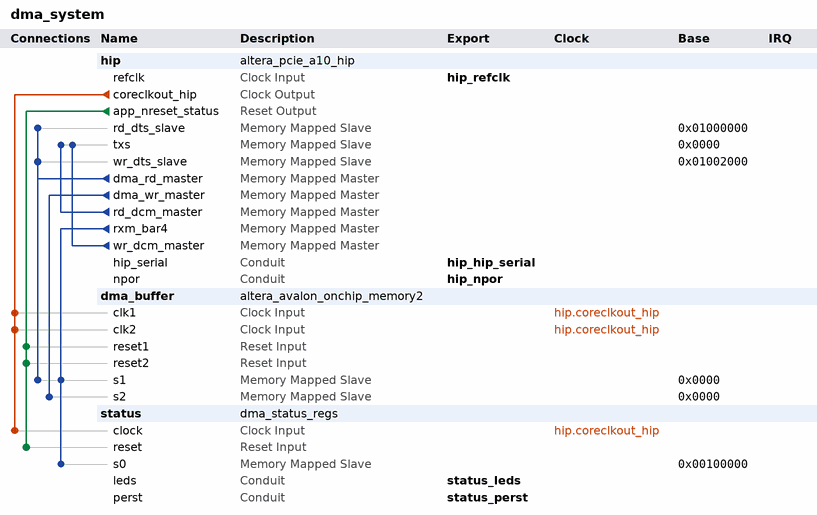
[diagram p0: system contents]
# Platform Designer (Qsys) system dma_system, Arria 10 10AX115N4F40E3SG
# Parameters at their usual value, and those the tool derives, are not listed.
package require -exact qsys 22.1
create_system dma_system
set_project_property DEVICE_FAMILY {Arria 10}
set_project_property DEVICE 10AX115N4F40E3SG

add_instance hip altera_pcie_a10_hip 22.1
set_instance_parameter_value hip adme_enable_hwtcl 0
set_instance_parameter_value hip advance_error_reporting_hwtcl 0
set_instance_parameter_value hip apps_type_hwtcl 0
set_instance_parameter_value hip ari_support_hwtcl 0
set_instance_parameter_value hip ast_trs_num_desc_hwtcl 16
set_instance_parameter_value hip ast_trs_rxdata_width_hwtcl 256
set_instance_parameter_value hip ast_trs_rxdesc_width_hwtcl 256
set_instance_parameter_value hip ast_trs_rxmty_width_hwtcl 32
set_instance_parameter_value hip ast_trs_txdata_width_hwtcl 256
set_instance_parameter_value hip ast_trs_txdesc_width_hwtcl 256
set_instance_parameter_value hip ast_trs_txmty_width_hwtcl 32
set_instance_parameter_value hip ast_trs_txstatus_width_hwtcl 256
set_instance_parameter_value hip avmm_addr_width_hwtcl 64
set_instance_parameter_value hip bar0_address_width_hwtcl 28
set_instance_parameter_value hip bar0_type_hwtcl {64-bit prefetchable memory}
set_instance_parameter_value hip bar1_address_width_hwtcl 0
set_instance_parameter_value hip bar1_type_hwtcl Disabled
set_instance_parameter_value hip bar2_address_width_hwtcl 8
set_instance_parameter_value hip bar2_type_hwtcl Disabled
set_instance_parameter_value hip bar3_address_width_hwtcl 0
set_instance_parameter_value hip bar3_type_hwtcl Disabled
set_instance_parameter_value hip bar4_address_width_hwtcl 21
set_instance_parameter_value hip bar4_type_hwtcl {64-bit prefetchable memory}
set_instance_parameter_value hip base_device NIGHTFURY5
set_instance_parameter_value hip bfm_drive_interface_clk_hwtcl 1
set_instance_parameter_value hip bfm_drive_interface_control_hwtcl 1
set_instance_parameter_value hip bfm_drive_interface_npor_hwtcl 1
set_instance_parameter_value hip bfm_drive_interface_pipe_hwtcl 1
set_instance_parameter_value hip cg_a2p_addr_map_pass_thru_bits_hwtcl 12
set_instance_parameter_value hip cg_enable_a2p_interrupt_hwtcl 0
set_instance_parameter_value hip cg_enable_advanced_interrupt_hwtcl 0
set_instance_parameter_value hip cg_impl_cra_av_slave_port_hwtcl 0
set_instance_parameter_value hip class_code_hwtcl 0
set_instance_parameter_value hip completion_timeout_hwtcl NONE
set_instance_parameter_value hip cseb_autonomous_hwtcl 0
set_instance_parameter_value hip cseb_config_bypass_gui_hwtcl 0
set_instance_parameter_value hip design_environment_hwtcl QSYS
set_instance_parameter_value hip devhide_support_hwtcl 0
set_instance_parameter_value hip device_embedded_ep_support_hwtcl 0
set_instance_parameter_value hip device_id_hwtcl 57348
set_instance_parameter_value hip dis_adapt 0
set_instance_parameter_value hip dma_use_scfifo_ext_hwtcl 0
set_instance_parameter_value hip eco_fb332688_dis_hwtcl 0
set_instance_parameter_value hip ecrc_check_capable_hwtcl 0
set_instance_parameter_value hip ecrc_gen_capable_hwtcl 0
set_instance_parameter_value hip enable_alternate_link_list_hwtcl 0
set_instance_parameter_value hip enable_ast_trs_hwtcl 0
set_instance_parameter_value hip enable_avst_reset_hwtcl 1
set_instance_parameter_value hip enable_custom_features_hwtcl 0
set_instance_parameter_value hip enable_devkit_conduit_hwtcl 0
set_instance_parameter_value hip enable_example_design_qii_hwtcl 1
set_instance_parameter_value hip enable_example_design_sim_hwtcl 1
set_instance_parameter_value hip enable_example_design_synth_hwtcl 1
set_instance_parameter_value hip enable_example_design_tb_hwtcl 1
set_instance_parameter_value hip enable_g3_bypass_equlz_rp_sim_hwtcl 0
set_instance_parameter_value hip enable_gen3phase2eq_timechange 0
set_instance_parameter_value hip enable_hip_status_for_avmm_hwtcl 0
set_instance_parameter_value hip enable_lmi_hwtcl 0
set_instance_parameter_value hip enable_nobar_slection_hwtcl 0
set_instance_parameter_value hip enable_rxm_burst_hwtcl 0
set_instance_parameter_value hip enable_skp_det 0
set_instance_parameter_value hip enable_soft_dfe 0
set_instance_parameter_value hip export_fpll_output_to_top_level_hwtcl 0
set_instance_parameter_value hip export_phy_input_to_top_level_hwtcl 0
set_instance_parameter_value hip extended_tag_support_hwtcl 0
set_instance_parameter_value hip flr_capability_user_hwtcl 0
set_instance_parameter_value hip force_tag_checking_on_hwtcl 0
set_instance_parameter_value hip gen3_coeff_1_hwtcl 8
set_instance_parameter_value hip gen3_coeff_3_ber_meas_hwtcl 12ms
set_instance_parameter_value hip include_virtio_capabilities_hwtcl 0
set_instance_parameter_value hip interface_type_hwtcl {Avalon-MM with DMA}
set_instance_parameter_value hip internal_controller_hwtcl 1
set_instance_parameter_value hip link2csr_width_hwtcl 16
set_instance_parameter_value hip maximum_payload_size_hwtcl 256
set_instance_parameter_value hip part_trait_device 10AX115N4F40E3SG
set_instance_parameter_value hip pf0_ats_invalidate_queue_depth_hwtcl 0
set_instance_parameter_value hip pf0_bar0_prefetchable_hwtcl 1
set_instance_parameter_value hip pf0_bar0_present_hwtcl 1
set_instance_parameter_value hip pf0_bar0_size_hwtcl 12
set_instance_parameter_value hip pf0_bar0_type_hwtcl 1
set_instance_parameter_value hip pf0_bar1_prefetchable_hwtcl 1
set_instance_parameter_value hip pf0_bar1_present_hwtcl 0
set_instance_parameter_value hip pf0_bar1_size_hwtcl 12
set_instance_parameter_value hip pf0_bar2_prefetchable_hwtcl 1
set_instance_parameter_value hip pf0_bar2_present_hwtcl 0
set_instance_parameter_value hip pf0_bar2_size_hwtcl 12
set_instance_parameter_value hip pf0_bar2_type_hwtcl 1
set_instance_parameter_value hip pf0_bar3_prefetchable_hwtcl 1
set_instance_parameter_value hip pf0_bar3_present_hwtcl 0
set_instance_parameter_value hip pf0_bar3_size_hwtcl 12
set_instance_parameter_value hip pf0_bar4_prefetchable_hwtcl 1
set_instance_parameter_value hip pf0_bar4_present_hwtcl 0
set_instance_parameter_value hip pf0_bar4_size_hwtcl 12
set_instance_parameter_value hip pf0_bar4_type_hwtcl 1
set_instance_parameter_value hip pf0_bar5_prefetchable_hwtcl 1
set_instance_parameter_value hip pf0_bar5_present_hwtcl 0
set_instance_parameter_value hip pf0_bar5_size_hwtcl 12
set_instance_parameter_value hip pf0_exprom_bar_present_hwtcl 0
set_instance_parameter_value hip pf0_exprom_bar_size_hwtcl 12
set_instance_parameter_value hip pf0_extra_bar_present_hwtcl 0
set_instance_parameter_value hip pf0_extra_bar_size_hwtcl 12
set_instance_parameter_value hip pf0_interrupt_pin_hwtcl inta
set_instance_parameter_value hip pf0_intr_line_hwtcl 0
set_instance_parameter_value hip pf0_msi_multi_message_capable_hwtcl 4
set_instance_parameter_value hip pf0_msix_pba_bir_hwtcl 0
set_instance_parameter_value hip pf0_msix_pba_offset_hwtcl 0
set_instance_parameter_value hip pf0_msix_table_bir_hwtcl 0
set_instance_parameter_value hip pf0_msix_table_offset_hwtcl 0
set_instance_parameter_value hip pf0_msix_table_size_hwtcl 0
set_instance_parameter_value hip pf0_pci_prog_intfc_byte_hwtcl 0
set_instance_parameter_value hip pf0_subclass_code_hwtcl 0
set_instance_parameter_value hip pf0_tph_dev_specific_mode_support_hwtcl 0
set_instance_parameter_value hip pf0_tph_int_mode_support_hwtcl 0
set_instance_parameter_value hip pf0_tph_st_table_location_hwtcl 0
set_instance_parameter_value hip pf0_tph_st_table_size_hwtcl 63
set_instance_parameter_value hip pf0_vf_bar0_prefetchable_hwtcl 1
set_instance_parameter_value hip pf0_vf_bar0_present_hwtcl 0
set_instance_parameter_value hip pf0_vf_bar0_size_hwtcl 12
set_instance_parameter_value hip pf0_vf_bar0_type_hwtcl 1
set_instance_parameter_value hip pf0_vf_bar1_prefetchable_hwtcl 1
set_instance_parameter_value hip pf0_vf_bar1_present_hwtcl 0
set_instance_parameter_value hip pf0_vf_bar1_size_hwtcl 12
set_instance_parameter_value hip pf0_vf_bar2_prefetchable_hwtcl 1
set_instance_parameter_value hip pf0_vf_bar2_present_hwtcl 0
set_instance_parameter_value hip pf0_vf_bar2_size_hwtcl 12
set_instance_parameter_value hip pf0_vf_bar2_type_hwtcl 1
set_instance_parameter_value hip pf0_vf_bar3_prefetchable_hwtcl 1
set_instance_parameter_value hip pf0_vf_bar3_present_hwtcl 0
set_instance_parameter_value hip pf0_vf_bar3_size_hwtcl 12
set_instance_parameter_value hip pf0_vf_bar4_prefetchable_hwtcl 1
set_instance_parameter_value hip pf0_vf_bar4_present_hwtcl 0
set_instance_parameter_value hip pf0_vf_bar4_size_hwtcl 12
set_instance_parameter_value hip pf0_vf_bar4_type_hwtcl 1
set_instance_parameter_value hip pf0_vf_bar5_prefetchable_hwtcl 1
set_instance_parameter_value hip pf0_vf_bar5_present_hwtcl 0
set_instance_parameter_value hip pf0_vf_bar5_size_hwtcl 12
set_instance_parameter_value hip pf0_vf_count_user_hwtcl 0
set_instance_parameter_value hip pf0_vf_device_id_hwtcl 0
set_instance_parameter_value hip pf0_vf_msix_pba_bir_hwtcl 0
set_instance_parameter_value hip pf0_vf_msix_pba_offset_hwtcl 0
set_instance_parameter_value hip pf0_vf_msix_tbl_bir_hwtcl 0
set_instance_parameter_value hip pf0_vf_msix_tbl_offset_hwtcl 0
set_instance_parameter_value hip pf0_vf_msix_tbl_size_hwtcl 0
set_instance_parameter_value hip pf0_vf_subsystem_device_id_hwtcl 0
set_instance_parameter_value hip pf0_vf_tph_dev_specific_mode_support_hwtcl 0
set_instance_parameter_value hip pf0_vf_tph_int_mode_support_hwtcl 0
set_instance_parameter_value hip pf0_vf_tph_st_table_location_hwtcl 0
set_instance_parameter_value hip pf0_vf_tph_st_table_size_hwtcl 63
set_instance_parameter_value hip pf0_virtio_capability_present_hwtcl 0
set_instance_parameter_value hip pf0_virtio_cmn_config_bar_indicator_hwtcl 0
set_instance_parameter_value hip pf0_virtio_cmn_config_bar_offset_hwtcl 0
set_instance_parameter_value hip pf0_virtio_cmn_config_structure_length_hwtcl 0
set_instance_parameter_value hip pf0_virtio_device_specific_cap_present_hwtcl 0
set_instance_parameter_value hip pf0_virtio_devspecific_bar_indicator_hwtcl 0
set_instance_parameter_value hip pf0_virtio_devspecific_bar_offset_hwtcl 0
set_instance_parameter_value hip pf0_virtio_devspecific_structure_length_hwtcl 0
set_instance_parameter_value hip pf0_virtio_isrstatus_bar_indicator_hwtcl 0
set_instance_parameter_value hip pf0_virtio_isrstatus_bar_offset_hwtcl 0
set_instance_parameter_value hip pf0_virtio_isrstatus_structure_length_hwtcl 0
set_instance_parameter_value hip pf0_virtio_notification_bar_indicator_hwtcl 0
set_instance_parameter_value hip pf0_virtio_notification_bar_offset_hwtcl 0
set_instance_parameter_value hip pf0_virtio_notification_structure_length_hwtcl 0
set_instance_parameter_value hip pf0_virtio_notify_off_multiplier_hwtcl 0
set_instance_parameter_value hip pf0_virtio_pciconfig_access_bar_indicator_hwtcl 0
set_instance_parameter_value hip pf0_virtio_pciconfig_access_bar_offset_hwtcl 0
set_instance_parameter_value hip pf0_virtio_pciconfig_access_structure_length_hwtcl 0
set_instance_parameter_value hip pf0vf_virtio_capability_present_hwtcl 0
set_instance_parameter_value hip pf0vf_virtio_cmn_config_bar_indicator_hwtcl 0
set_instance_parameter_value hip pf0vf_virtio_cmn_config_bar_offset_hwtcl 0
set_instance_parameter_value hip pf0vf_virtio_cmn_config_structure_length_hwtcl 0
set_instance_parameter_value hip pf0vf_virtio_device_specific_cap_present_hwtcl 0
set_instance_parameter_value hip pf0vf_virtio_devspecific_bar_indicator_hwtcl 0
set_instance_parameter_value hip pf0vf_virtio_devspecific_bar_offset_hwtcl 0
set_instance_parameter_value hip pf0vf_virtio_devspecific_structure_length_hwtcl 0
set_instance_parameter_value hip pf0vf_virtio_isrstatus_bar_indicator_hwtcl 0
set_instance_parameter_value hip pf0vf_virtio_isrstatus_bar_offset_hwtcl 0
set_instance_parameter_value hip pf0vf_virtio_isrstatus_structure_length_hwtcl 0
set_instance_parameter_value hip pf0vf_virtio_notification_bar_indicator_hwtcl 0
set_instance_parameter_value hip pf0vf_virtio_notification_bar_offset_hwtcl 0
set_instance_parameter_value hip pf0vf_virtio_notification_structure_length_hwtcl 0
set_instance_parameter_value hip pf0vf_virtio_notify_off_multiplier_hwtcl 0
set_instance_parameter_value hip pf0vf_virtio_pciconfig_access_bar_indicator_hwtcl 0
set_instance_parameter_value hip pf0vf_virtio_pciconfig_access_bar_offset_hwtcl 0
set_instance_parameter_value hip pf0vf_virtio_pciconfig_access_structure_length_hwtcl 0
set_instance_parameter_value hip pf1_ats_invalidate_queue_depth_hwtcl 0
set_instance_parameter_value hip pf1_bar0_prefetchable_hwtcl 1
set_instance_parameter_value hip pf1_bar0_present_hwtcl 0
set_instance_parameter_value hip pf1_bar0_size_hwtcl 12
set_instance_parameter_value hip pf1_bar0_type_hwtcl 1
set_instance_parameter_value hip pf1_bar1_prefetchable_hwtcl 1
set_instance_parameter_value hip pf1_bar1_present_hwtcl 0
set_instance_parameter_value hip pf1_bar1_size_hwtcl 12
set_instance_parameter_value hip pf1_bar2_prefetchable_hwtcl 1
set_instance_parameter_value hip pf1_bar2_present_hwtcl 0
set_instance_parameter_value hip pf1_bar2_size_hwtcl 12
set_instance_parameter_value hip pf1_bar2_type_hwtcl 1
set_instance_parameter_value hip pf1_bar3_prefetchable_hwtcl 1
set_instance_parameter_value hip pf1_bar3_present_hwtcl 0
set_instance_parameter_value hip pf1_bar3_size_hwtcl 12
set_instance_parameter_value hip pf1_bar4_prefetchable_hwtcl 1
set_instance_parameter_value hip pf1_bar4_present_hwtcl 0
set_instance_parameter_value hip pf1_bar4_size_hwtcl 12
set_instance_parameter_value hip pf1_bar4_type_hwtcl 1
set_instance_parameter_value hip pf1_bar5_prefetchable_hwtcl 1
set_instance_parameter_value hip pf1_bar5_present_hwtcl 0
set_instance_parameter_value hip pf1_bar5_size_hwtcl 12
set_instance_parameter_value hip pf1_class_code_hwtcl 0
set_instance_parameter_value hip pf1_device_id_hwtcl 0
set_instance_parameter_value hip pf1_exprom_bar_present_hwtcl 0
set_instance_parameter_value hip pf1_exprom_bar_size_hwtcl 12
set_instance_parameter_value hip pf1_interrupt_pin_hwtcl inta
set_instance_parameter_value hip pf1_intr_line_hwtcl 0
set_instance_parameter_value hip pf1_msi_multi_message_capable_hwtcl 4
set_instance_parameter_value hip pf1_msix_pba_bir_hwtcl 0
set_instance_parameter_value hip pf1_msix_pba_offset_hwtcl 0
set_instance_parameter_value hip pf1_msix_table_bir_hwtcl 0
set_instance_parameter_value hip pf1_msix_table_offset_hwtcl 0
set_instance_parameter_value hip pf1_msix_table_size_hwtcl 0
set_instance_parameter_value hip pf1_pci_prog_intfc_byte_hwtcl 0
set_instance_parameter_value hip pf1_revision_id_hwtcl 0
set_instance_parameter_value hip pf1_subclass_code_hwtcl 0
set_instance_parameter_value hip pf1_subsystem_device_id_hwtcl 0
set_instance_parameter_value hip pf1_subsystem_vendor_id_hwtcl 0
set_instance_parameter_value hip pf1_tph_dev_specific_mode_support_hwtcl 0
set_instance_parameter_value hip pf1_tph_int_mode_support_hwtcl 0
set_instance_parameter_value hip pf1_tph_st_table_location_hwtcl 0
set_instance_parameter_value hip pf1_tph_st_table_size_hwtcl 63
set_instance_parameter_value hip pf1_vendor_id_hwtcl 0
set_instance_parameter_value hip pf1_vf_bar0_prefetchable_hwtcl 1
set_instance_parameter_value hip pf1_vf_bar0_present_hwtcl 0
set_instance_parameter_value hip pf1_vf_bar0_size_hwtcl 12
set_instance_parameter_value hip pf1_vf_bar0_type_hwtcl 1
set_instance_parameter_value hip pf1_vf_bar1_prefetchable_hwtcl 1
set_instance_parameter_value hip pf1_vf_bar1_present_hwtcl 0
set_instance_parameter_value hip pf1_vf_bar1_size_hwtcl 12
set_instance_parameter_value hip pf1_vf_bar2_prefetchable_hwtcl 1
set_instance_parameter_value hip pf1_vf_bar2_present_hwtcl 0
set_instance_parameter_value hip pf1_vf_bar2_size_hwtcl 12
set_instance_parameter_value hip pf1_vf_bar2_type_hwtcl 1
set_instance_parameter_value hip pf1_vf_bar3_prefetchable_hwtcl 1
set_instance_parameter_value hip pf1_vf_bar3_present_hwtcl 0
set_instance_parameter_value hip pf1_vf_bar3_size_hwtcl 12
set_instance_parameter_value hip pf1_vf_bar4_prefetchable_hwtcl 1
set_instance_parameter_value hip pf1_vf_bar4_present_hwtcl 0
set_instance_parameter_value hip pf1_vf_bar4_size_hwtcl 12
set_instance_parameter_value hip pf1_vf_bar4_type_hwtcl 1
set_instance_parameter_value hip pf1_vf_bar5_prefetchable_hwtcl 1
set_instance_parameter_value hip pf1_vf_bar5_present_hwtcl 0
set_instance_parameter_value hip pf1_vf_bar5_size_hwtcl 12
set_instance_parameter_value hip pf1_vf_count_user_hwtcl 0
set_instance_parameter_value hip pf1_vf_device_id_hwtcl 0
set_instance_parameter_value hip pf1_vf_msix_pba_bir_hwtcl 0
set_instance_parameter_value hip pf1_vf_msix_pba_offset_hwtcl 0
set_instance_parameter_value hip pf1_vf_msix_tbl_bir_hwtcl 0
set_instance_parameter_value hip pf1_vf_msix_tbl_offset_hwtcl 0
set_instance_parameter_value hip pf1_vf_msix_tbl_size_hwtcl 0
set_instance_parameter_value hip pf1_vf_subsystem_device_id_hwtcl 0
set_instance_parameter_value hip pf1_vf_tph_dev_specific_mode_support_hwtcl 0
set_instance_parameter_value hip pf1_vf_tph_int_mode_support_hwtcl 0
set_instance_parameter_value hip pf1_vf_tph_st_table_location_hwtcl 0
set_instance_parameter_value hip pf1_vf_tph_st_table_size_hwtcl 63
set_instance_parameter_value hip pf1_virtio_capability_present_hwtcl 0
set_instance_parameter_value hip pf1_virtio_cmn_config_bar_indicator_hwtcl 0
set_instance_parameter_value hip pf1_virtio_cmn_config_bar_offset_hwtcl 0
set_instance_parameter_value hip pf1_virtio_cmn_config_structure_length_hwtcl 0
set_instance_parameter_value hip pf1_virtio_device_specific_cap_present_hwtcl 0
set_instance_parameter_value hip pf1_virtio_devspecific_bar_indicator_hwtcl 0
set_instance_parameter_value hip pf1_virtio_devspecific_bar_offset_hwtcl 0
set_instance_parameter_value hip pf1_virtio_devspecific_structure_length_hwtcl 0
set_instance_parameter_value hip pf1_virtio_isrstatus_bar_indicator_hwtcl 0
set_instance_parameter_value hip pf1_virtio_isrstatus_bar_offset_hwtcl 0
set_instance_parameter_value hip pf1_virtio_isrstatus_structure_length_hwtcl 0
set_instance_parameter_value hip pf1_virtio_notification_bar_indicator_hwtcl 0
set_instance_parameter_value hip pf1_virtio_notification_bar_offset_hwtcl 0
set_instance_parameter_value hip pf1_virtio_notification_structure_length_hwtcl 0
set_instance_parameter_value hip pf1_virtio_notify_off_multiplier_hwtcl 0
set_instance_parameter_value hip pf1_virtio_pciconfig_access_bar_indicator_hwtcl 0
set_instance_parameter_value hip pf1_virtio_pciconfig_access_bar_offset_hwtcl 0
set_instance_parameter_value hip pf1_virtio_pciconfig_access_structure_length_hwtcl 0
set_instance_parameter_value hip pf1vf_virtio_capability_present_hwtcl 0
set_instance_parameter_value hip pf1vf_virtio_cmn_config_bar_indicator_hwtcl 0
set_instance_parameter_value hip pf1vf_virtio_cmn_config_bar_offset_hwtcl 0
set_instance_parameter_value hip pf1vf_virtio_cmn_config_structure_length_hwtcl 0
set_instance_parameter_value hip pf1vf_virtio_device_specific_cap_present_hwtcl 0
set_instance_parameter_value hip pf1vf_virtio_devspecific_bar_indicator_hwtcl 0
set_instance_parameter_value hip pf1vf_virtio_devspecific_bar_offset_hwtcl 0
set_instance_parameter_value hip pf1vf_virtio_devspecific_structure_length_hwtcl 0
set_instance_parameter_value hip pf1vf_virtio_isrstatus_bar_indicator_hwtcl 0
set_instance_parameter_value hip pf1vf_virtio_isrstatus_bar_offset_hwtcl 0
set_instance_parameter_value hip pf1vf_virtio_isrstatus_structure_length_hwtcl 0
set_instance_parameter_value hip pf1vf_virtio_notification_bar_indicator_hwtcl 0
set_instance_parameter_value hip pf1vf_virtio_notification_bar_offset_hwtcl 0
set_instance_parameter_value hip pf1vf_virtio_notification_structure_length_hwtcl 0
set_instance_parameter_value hip pf1vf_virtio_notify_off_multiplier_hwtcl 0
set_instance_parameter_value hip pf1vf_virtio_pciconfig_access_bar_indicator_hwtcl 0
set_instance_parameter_value hip pf1vf_virtio_pciconfig_access_bar_offset_hwtcl 0
set_instance_parameter_value hip pf1vf_virtio_pciconfig_access_structure_length_hwtcl 0
set_instance_parameter_value hip pf2_ats_invalidate_queue_depth_hwtcl 0
set_instance_parameter_value hip pf2_bar0_prefetchable_hwtcl 1
set_instance_parameter_value hip pf2_bar0_present_hwtcl 0
set_instance_parameter_value hip pf2_bar0_size_hwtcl 12
set_instance_parameter_value hip pf2_bar0_type_hwtcl 1
set_instance_parameter_value hip pf2_bar1_prefetchable_hwtcl 1
set_instance_parameter_value hip pf2_bar1_present_hwtcl 0
set_instance_parameter_value hip pf2_bar1_size_hwtcl 12
set_instance_parameter_value hip pf2_bar2_prefetchable_hwtcl 1
set_instance_parameter_value hip pf2_bar2_present_hwtcl 0
set_instance_parameter_value hip pf2_bar2_size_hwtcl 12
set_instance_parameter_value hip pf2_bar2_type_hwtcl 1
set_instance_parameter_value hip pf2_bar3_prefetchable_hwtcl 1
set_instance_parameter_value hip pf2_bar3_present_hwtcl 0
set_instance_parameter_value hip pf2_bar3_size_hwtcl 12
set_instance_parameter_value hip pf2_bar4_prefetchable_hwtcl 1
set_instance_parameter_value hip pf2_bar4_present_hwtcl 0
set_instance_parameter_value hip pf2_bar4_size_hwtcl 12
set_instance_parameter_value hip pf2_bar4_type_hwtcl 1
set_instance_parameter_value hip pf2_bar5_prefetchable_hwtcl 1
set_instance_parameter_value hip pf2_bar5_present_hwtcl 0
set_instance_parameter_value hip pf2_bar5_size_hwtcl 12
set_instance_parameter_value hip pf2_class_code_hwtcl 0
set_instance_parameter_value hip pf2_device_id_hwtcl 0
set_instance_parameter_value hip pf2_exprom_bar_present_hwtcl 0
set_instance_parameter_value hip pf2_exprom_bar_size_hwtcl 12
set_instance_parameter_value hip pf2_interrupt_pin_hwtcl inta
set_instance_parameter_value hip pf2_intr_line_hwtcl 0
set_instance_parameter_value hip pf2_msi_multi_message_capable_hwtcl 4
set_instance_parameter_value hip pf2_msix_pba_bir_hwtcl 0
set_instance_parameter_value hip pf2_msix_pba_offset_hwtcl 0
set_instance_parameter_value hip pf2_msix_table_bir_hwtcl 0
set_instance_parameter_value hip pf2_msix_table_offset_hwtcl 0
set_instance_parameter_value hip pf2_msix_table_size_hwtcl 0
set_instance_parameter_value hip pf2_pci_prog_intfc_byte_hwtcl 0
set_instance_parameter_value hip pf2_revision_id_hwtcl 0
set_instance_parameter_value hip pf2_subclass_code_hwtcl 0
set_instance_parameter_value hip pf2_subsystem_device_id_hwtcl 0
set_instance_parameter_value hip pf2_subsystem_vendor_id_hwtcl 0
set_instance_parameter_value hip pf2_tph_dev_specific_mode_support_hwtcl 0
set_instance_parameter_value hip pf2_tph_int_mode_support_hwtcl 0
set_instance_parameter_value hip pf2_tph_st_table_location_hwtcl 0
set_instance_parameter_value hip pf2_tph_st_table_size_hwtcl 63
set_instance_parameter_value hip pf2_vendor_id_hwtcl 0
set_instance_parameter_value hip pf2_vf_bar0_prefetchable_hwtcl 1
set_instance_parameter_value hip pf2_vf_bar0_present_hwtcl 0
set_instance_parameter_value hip pf2_vf_bar0_size_hwtcl 12
set_instance_parameter_value hip pf2_vf_bar0_type_hwtcl 1
set_instance_parameter_value hip pf2_vf_bar1_prefetchable_hwtcl 1
set_instance_parameter_value hip pf2_vf_bar1_present_hwtcl 0
set_instance_parameter_value hip pf2_vf_bar1_size_hwtcl 12
set_instance_parameter_value hip pf2_vf_bar2_prefetchable_hwtcl 1
set_instance_parameter_value hip pf2_vf_bar2_present_hwtcl 0
set_instance_parameter_value hip pf2_vf_bar2_size_hwtcl 12
set_instance_parameter_value hip pf2_vf_bar2_type_hwtcl 1
set_instance_parameter_value hip pf2_vf_bar3_prefetchable_hwtcl 1
set_instance_parameter_value hip pf2_vf_bar3_present_hwtcl 0
set_instance_parameter_value hip pf2_vf_bar3_size_hwtcl 12
set_instance_parameter_value hip pf2_vf_bar4_prefetchable_hwtcl 1
set_instance_parameter_value hip pf2_vf_bar4_present_hwtcl 0
set_instance_parameter_value hip pf2_vf_bar4_size_hwtcl 12
set_instance_parameter_value hip pf2_vf_bar4_type_hwtcl 1
set_instance_parameter_value hip pf2_vf_bar5_prefetchable_hwtcl 1
set_instance_parameter_value hip pf2_vf_bar5_present_hwtcl 0
set_instance_parameter_value hip pf2_vf_bar5_size_hwtcl 12
set_instance_parameter_value hip pf2_vf_count_user_hwtcl 0
set_instance_parameter_value hip pf2_vf_device_id_hwtcl 0
set_instance_parameter_value hip pf2_vf_msix_pba_bir_hwtcl 0
set_instance_parameter_value hip pf2_vf_msix_pba_offset_hwtcl 0
set_instance_parameter_value hip pf2_vf_msix_tbl_bir_hwtcl 0
set_instance_parameter_value hip pf2_vf_msix_tbl_offset_hwtcl 0
set_instance_parameter_value hip pf2_vf_msix_tbl_size_hwtcl 0
set_instance_parameter_value hip pf2_vf_subsystem_device_id_hwtcl 0
set_instance_parameter_value hip pf2_vf_tph_dev_specific_mode_support_hwtcl 0
set_instance_parameter_value hip pf2_vf_tph_int_mode_support_hwtcl 0
set_instance_parameter_value hip pf2_vf_tph_st_table_location_hwtcl 0
set_instance_parameter_value hip pf2_vf_tph_st_table_size_hwtcl 63
set_instance_parameter_value hip pf2_virtio_capability_present_hwtcl 0
set_instance_parameter_value hip pf2_virtio_cmn_config_bar_indicator_hwtcl 0
set_instance_parameter_value hip pf2_virtio_cmn_config_bar_offset_hwtcl 0
set_instance_parameter_value hip pf2_virtio_cmn_config_structure_length_hwtcl 0
set_instance_parameter_value hip pf2_virtio_device_specific_cap_present_hwtcl 0
set_instance_parameter_value hip pf2_virtio_devspecific_bar_indicator_hwtcl 0
set_instance_parameter_value hip pf2_virtio_devspecific_bar_offset_hwtcl 0
set_instance_parameter_value hip pf2_virtio_devspecific_structure_length_hwtcl 0
set_instance_parameter_value hip pf2_virtio_isrstatus_bar_indicator_hwtcl 0
set_instance_parameter_value hip pf2_virtio_isrstatus_bar_offset_hwtcl 0
set_instance_parameter_value hip pf2_virtio_isrstatus_structure_length_hwtcl 0
set_instance_parameter_value hip pf2_virtio_notification_bar_indicator_hwtcl 0
set_instance_parameter_value hip pf2_virtio_notification_bar_offset_hwtcl 0
set_instance_parameter_value hip pf2_virtio_notification_structure_length_hwtcl 0
set_instance_parameter_value hip pf2_virtio_notify_off_multiplier_hwtcl 0
set_instance_parameter_value hip pf2_virtio_pciconfig_access_bar_indicator_hwtcl 0
set_instance_parameter_value hip pf2_virtio_pciconfig_access_bar_offset_hwtcl 0
set_instance_parameter_value hip pf2_virtio_pciconfig_access_structure_length_hwtcl 0
set_instance_parameter_value hip pf2vf_virtio_capability_present_hwtcl 0
set_instance_parameter_value hip pf2vf_virtio_cmn_config_bar_indicator_hwtcl 0
set_instance_parameter_value hip pf2vf_virtio_cmn_config_bar_offset_hwtcl 0
set_instance_parameter_value hip pf2vf_virtio_cmn_config_structure_length_hwtcl 0
set_instance_parameter_value hip pf2vf_virtio_device_specific_cap_present_hwtcl 0
set_instance_parameter_value hip pf2vf_virtio_devspecific_bar_indicator_hwtcl 0
set_instance_parameter_value hip pf2vf_virtio_devspecific_bar_offset_hwtcl 0
set_instance_parameter_value hip pf2vf_virtio_devspecific_structure_length_hwtcl 0
set_instance_parameter_value hip pf2vf_virtio_isrstatus_bar_indicator_hwtcl 0
set_instance_parameter_value hip pf2vf_virtio_isrstatus_bar_offset_hwtcl 0
set_instance_parameter_value hip pf2vf_virtio_isrstatus_structure_length_hwtcl 0
set_instance_parameter_value hip pf2vf_virtio_notification_bar_indicator_hwtcl 0
set_instance_parameter_value hip pf2vf_virtio_notification_bar_offset_hwtcl 0
set_instance_parameter_value hip pf2vf_virtio_notification_structure_length_hwtcl 0
set_instance_parameter_value hip pf2vf_virtio_notify_off_multiplier_hwtcl 0
set_instance_parameter_value hip pf2vf_virtio_pciconfig_access_bar_indicator_hwtcl 0
set_instance_parameter_value hip pf2vf_virtio_pciconfig_access_bar_offset_hwtcl 0
set_instance_parameter_value hip pf2vf_virtio_pciconfig_access_structure_length_hwtcl 0
set_instance_parameter_value hip pf3_ats_invalidate_queue_depth_hwtcl 0
set_instance_parameter_value hip pf3_bar0_prefetchable_hwtcl 1
set_instance_parameter_value hip pf3_bar0_present_hwtcl 0
set_instance_parameter_value hip pf3_bar0_size_hwtcl 12
set_instance_parameter_value hip pf3_bar0_type_hwtcl 1
set_instance_parameter_value hip pf3_bar1_prefetchable_hwtcl 1
set_instance_parameter_value hip pf3_bar1_present_hwtcl 0
set_instance_parameter_value hip pf3_bar1_size_hwtcl 12
set_instance_parameter_value hip pf3_bar2_prefetchable_hwtcl 1
set_instance_parameter_value hip pf3_bar2_present_hwtcl 0
set_instance_parameter_value hip pf3_bar2_size_hwtcl 12
set_instance_parameter_value hip pf3_bar2_type_hwtcl 1
set_instance_parameter_value hip pf3_bar3_prefetchable_hwtcl 1
set_instance_parameter_value hip pf3_bar3_present_hwtcl 0
set_instance_parameter_value hip pf3_bar3_size_hwtcl 12
set_instance_parameter_value hip pf3_bar4_prefetchable_hwtcl 1
set_instance_parameter_value hip pf3_bar4_present_hwtcl 0
set_instance_parameter_value hip pf3_bar4_size_hwtcl 12
set_instance_parameter_value hip pf3_bar4_type_hwtcl 1
set_instance_parameter_value hip pf3_bar5_prefetchable_hwtcl 1
set_instance_parameter_value hip pf3_bar5_present_hwtcl 0
set_instance_parameter_value hip pf3_bar5_size_hwtcl 12
set_instance_parameter_value hip pf3_class_code_hwtcl 0
set_instance_parameter_value hip pf3_device_id_hwtcl 0
set_instance_parameter_value hip pf3_exprom_bar_present_hwtcl 0
set_instance_parameter_value hip pf3_exprom_bar_size_hwtcl 12
set_instance_parameter_value hip pf3_interrupt_pin_hwtcl inta
set_instance_parameter_value hip pf3_intr_line_hwtcl 0
set_instance_parameter_value hip pf3_msi_multi_message_capable_hwtcl 4
set_instance_parameter_value hip pf3_msix_pba_bir_hwtcl 0
set_instance_parameter_value hip pf3_msix_pba_offset_hwtcl 0
set_instance_parameter_value hip pf3_msix_table_bir_hwtcl 0
set_instance_parameter_value hip pf3_msix_table_offset_hwtcl 0
set_instance_parameter_value hip pf3_msix_table_size_hwtcl 0
set_instance_parameter_value hip pf3_pci_prog_intfc_byte_hwtcl 0
set_instance_parameter_value hip pf3_revision_id_hwtcl 0
set_instance_parameter_value hip pf3_subclass_code_hwtcl 0
set_instance_parameter_value hip pf3_subsystem_device_id_hwtcl 0
set_instance_parameter_value hip pf3_subsystem_vendor_id_hwtcl 0
set_instance_parameter_value hip pf3_tph_dev_specific_mode_support_hwtcl 0
set_instance_parameter_value hip pf3_tph_int_mode_support_hwtcl 0
set_instance_parameter_value hip pf3_tph_st_table_location_hwtcl 0
set_instance_parameter_value hip pf3_tph_st_table_size_hwtcl 63
set_instance_parameter_value hip pf3_vendor_id_hwtcl 0
set_instance_parameter_value hip pf3_vf_bar0_prefetchable_hwtcl 1
set_instance_parameter_value hip pf3_vf_bar0_present_hwtcl 0
set_instance_parameter_value hip pf3_vf_bar0_size_hwtcl 12
set_instance_parameter_value hip pf3_vf_bar0_type_hwtcl 1
set_instance_parameter_value hip pf3_vf_bar1_prefetchable_hwtcl 1
set_instance_parameter_value hip pf3_vf_bar1_present_hwtcl 0
set_instance_parameter_value hip pf3_vf_bar1_size_hwtcl 12
set_instance_parameter_value hip pf3_vf_bar2_prefetchable_hwtcl 1
set_instance_parameter_value hip pf3_vf_bar2_present_hwtcl 0
set_instance_parameter_value hip pf3_vf_bar2_size_hwtcl 12
set_instance_parameter_value hip pf3_vf_bar2_type_hwtcl 1
set_instance_parameter_value hip pf3_vf_bar3_prefetchable_hwtcl 1
set_instance_parameter_value hip pf3_vf_bar3_present_hwtcl 0
set_instance_parameter_value hip pf3_vf_bar3_size_hwtcl 12
set_instance_parameter_value hip pf3_vf_bar4_prefetchable_hwtcl 1
set_instance_parameter_value hip pf3_vf_bar4_present_hwtcl 0
set_instance_parameter_value hip pf3_vf_bar4_size_hwtcl 12
set_instance_parameter_value hip pf3_vf_bar4_type_hwtcl 1
set_instance_parameter_value hip pf3_vf_bar5_prefetchable_hwtcl 1
set_instance_parameter_value hip pf3_vf_bar5_present_hwtcl 0
set_instance_parameter_value hip pf3_vf_bar5_size_hwtcl 12
set_instance_parameter_value hip pf3_vf_count_user_hwtcl 0
set_instance_parameter_value hip pf3_vf_device_id_hwtcl 0
set_instance_parameter_value hip pf3_vf_msix_pba_bir_hwtcl 0
set_instance_parameter_value hip pf3_vf_msix_pba_offset_hwtcl 0
set_instance_parameter_value hip pf3_vf_msix_tbl_bir_hwtcl 0
set_instance_parameter_value hip pf3_vf_msix_tbl_offset_hwtcl 0
set_instance_parameter_value hip pf3_vf_msix_tbl_size_hwtcl 0
set_instance_parameter_value hip pf3_vf_subsystem_device_id_hwtcl 0
set_instance_parameter_value hip pf3_vf_tph_dev_specific_mode_support_hwtcl 0
set_instance_parameter_value hip pf3_vf_tph_int_mode_support_hwtcl 0
set_instance_parameter_value hip pf3_vf_tph_st_table_location_hwtcl 0
set_instance_parameter_value hip pf3_vf_tph_st_table_size_hwtcl 63
set_instance_parameter_value hip pf3_virtio_capability_present_hwtcl 0
set_instance_parameter_value hip pf3_virtio_cmn_config_bar_indicator_hwtcl 0
set_instance_parameter_value hip pf3_virtio_cmn_config_bar_offset_hwtcl 0
set_instance_parameter_value hip pf3_virtio_cmn_config_structure_length_hwtcl 0
set_instance_parameter_value hip pf3_virtio_device_specific_cap_present_hwtcl 0
set_instance_parameter_value hip pf3_virtio_devspecific_bar_indicator_hwtcl 0
set_instance_parameter_value hip pf3_virtio_devspecific_bar_offset_hwtcl 0
set_instance_parameter_value hip pf3_virtio_devspecific_structure_length_hwtcl 0
set_instance_parameter_value hip pf3_virtio_isrstatus_bar_indicator_hwtcl 0
set_instance_parameter_value hip pf3_virtio_isrstatus_bar_offset_hwtcl 0
set_instance_parameter_value hip pf3_virtio_isrstatus_structure_length_hwtcl 0
set_instance_parameter_value hip pf3_virtio_notification_bar_indicator_hwtcl 0
set_instance_parameter_value hip pf3_virtio_notification_bar_offset_hwtcl 0
set_instance_parameter_value hip pf3_virtio_notification_structure_length_hwtcl 0
set_instance_parameter_value hip pf3_virtio_notify_off_multiplier_hwtcl 0
set_instance_parameter_value hip pf3_virtio_pciconfig_access_bar_indicator_hwtcl 0
set_instance_parameter_value hip pf3_virtio_pciconfig_access_bar_offset_hwtcl 0
set_instance_parameter_value hip pf3_virtio_pciconfig_access_structure_length_hwtcl 0
set_instance_parameter_value hip pf3vf_virtio_capability_present_hwtcl 0
set_instance_parameter_value hip pf3vf_virtio_cmn_config_bar_indicator_hwtcl 0
set_instance_parameter_value hip pf3vf_virtio_cmn_config_bar_offset_hwtcl 0
set_instance_parameter_value hip pf3vf_virtio_cmn_config_structure_length_hwtcl 0
set_instance_parameter_value hip pf3vf_virtio_device_specific_cap_present_hwtcl 0
set_instance_parameter_value hip pf3vf_virtio_devspecific_bar_indicator_hwtcl 0
set_instance_parameter_value hip pf3vf_virtio_devspecific_bar_offset_hwtcl 0
set_instance_parameter_value hip pf3vf_virtio_devspecific_structure_length_hwtcl 0
set_instance_parameter_value hip pf3vf_virtio_isrstatus_bar_indicator_hwtcl 0
set_instance_parameter_value hip pf3vf_virtio_isrstatus_bar_offset_hwtcl 0
set_instance_parameter_value hip pf3vf_virtio_isrstatus_structure_length_hwtcl 0
set_instance_parameter_value hip pf3vf_virtio_notification_bar_indicator_hwtcl 0
set_instance_parameter_value hip pf3vf_virtio_notification_bar_offset_hwtcl 0
set_instance_parameter_value hip pf3vf_virtio_notification_structure_length_hwtcl 0
set_instance_parameter_value hip pf3vf_virtio_notify_off_multiplier_hwtcl 0
set_instance_parameter_value hip pf3vf_virtio_pciconfig_access_bar_indicator_hwtcl 0
set_instance_parameter_value hip pf3vf_virtio_pciconfig_access_bar_offset_hwtcl 0
set_instance_parameter_value hip pf3vf_virtio_pciconfig_access_structure_length_hwtcl 0
set_instance_parameter_value hip pf4_bar0_prefetchable_hwtcl 1
set_instance_parameter_value hip pf4_bar0_present_hwtcl 0
set_instance_parameter_value hip pf4_bar0_size_hwtcl 12
set_instance_parameter_value hip pf4_bar0_type_hwtcl 1
set_instance_parameter_value hip pf4_bar1_prefetchable_hwtcl 1
set_instance_parameter_value hip pf4_bar1_present_hwtcl 0
set_instance_parameter_value hip pf4_bar1_size_hwtcl 12
set_instance_parameter_value hip pf4_bar2_prefetchable_hwtcl 1
set_instance_parameter_value hip pf4_bar2_present_hwtcl 0
set_instance_parameter_value hip pf4_bar2_size_hwtcl 12
set_instance_parameter_value hip pf4_bar2_type_hwtcl 1
set_instance_parameter_value hip pf4_bar3_prefetchable_hwtcl 1
set_instance_parameter_value hip pf4_bar3_present_hwtcl 0
set_instance_parameter_value hip pf4_bar3_size_hwtcl 12
set_instance_parameter_value hip pf4_bar4_prefetchable_hwtcl 1
set_instance_parameter_value hip pf4_bar4_present_hwtcl 0
set_instance_parameter_value hip pf4_bar4_size_hwtcl 12
set_instance_parameter_value hip pf4_bar4_type_hwtcl 1
set_instance_parameter_value hip pf4_bar5_prefetchable_hwtcl 1
set_instance_parameter_value hip pf4_bar5_present_hwtcl 0
set_instance_parameter_value hip pf4_bar5_size_hwtcl 12
set_instance_parameter_value hip pf4_class_code_hwtcl 0
set_instance_parameter_value hip pf4_device_id_hwtcl 0
set_instance_parameter_value hip pf4_exprom_bar_present_hwtcl 0
set_instance_parameter_value hip pf4_exprom_bar_size_hwtcl 12
set_instance_parameter_value hip pf4_interrupt_pin_hwtcl inta
set_instance_parameter_value hip pf4_intr_line_hwtcl 0
set_instance_parameter_value hip pf4_msi_multi_message_capable_hwtcl 4
set_instance_parameter_value hip pf4_msix_pba_bir_hwtcl 0
set_instance_parameter_value hip pf4_msix_pba_offset_hwtcl 0
set_instance_parameter_value hip pf4_msix_table_bir_hwtcl 0
set_instance_parameter_value hip pf4_msix_table_offset_hwtcl 0
set_instance_parameter_value hip pf4_msix_table_size_hwtcl 0
set_instance_parameter_value hip pf4_pci_prog_intfc_byte_hwtcl 0
set_instance_parameter_value hip pf4_revision_id_hwtcl 0
set_instance_parameter_value hip pf4_subclass_code_hwtcl 0
set_instance_parameter_value hip pf4_subsystem_device_id_hwtcl 0
set_instance_parameter_value hip pf4_subsystem_vendor_id_hwtcl 0
set_instance_parameter_value hip pf4_vendor_id_hwtcl 0
set_instance_parameter_value hip pf4_vf_device_id_hwtcl 0
set_instance_parameter_value hip pf4_vf_subsystem_device_id_hwtcl 0
set_instance_parameter_value hip pf4_virtio_capability_present_hwtcl 0
set_instance_parameter_value hip pf4_virtio_cmn_config_bar_indicator_hwtcl 0
set_instance_parameter_value hip pf4_virtio_cmn_config_bar_offset_hwtcl 0
set_instance_parameter_value hip pf4_virtio_cmn_config_structure_length_hwtcl 0
set_instance_parameter_value hip pf4_virtio_device_specific_cap_present_hwtcl 0
set_instance_parameter_value hip pf4_virtio_devspecific_bar_indicator_hwtcl 0
set_instance_parameter_value hip pf4_virtio_devspecific_bar_offset_hwtcl 0
set_instance_parameter_value hip pf4_virtio_devspecific_structure_length_hwtcl 0
set_instance_parameter_value hip pf4_virtio_isrstatus_bar_indicator_hwtcl 0
set_instance_parameter_value hip pf4_virtio_isrstatus_bar_offset_hwtcl 0
set_instance_parameter_value hip pf4_virtio_isrstatus_structure_length_hwtcl 0
set_instance_parameter_value hip pf4_virtio_notification_bar_indicator_hwtcl 0
set_instance_parameter_value hip pf4_virtio_notification_bar_offset_hwtcl 0
set_instance_parameter_value hip pf4_virtio_notification_structure_length_hwtcl 0
set_instance_parameter_value hip pf4_virtio_notify_off_multiplier_hwtcl 0
set_instance_parameter_value hip pf4_virtio_pciconfig_access_bar_indicator_hwtcl 0
set_instance_parameter_value hip pf4_virtio_pciconfig_access_bar_offset_hwtcl 0
set_instance_parameter_value hip pf4_virtio_pciconfig_access_structure_length_hwtcl 0
set_instance_parameter_value hip pf5_bar0_prefetchable_hwtcl 1
set_instance_parameter_value hip pf5_bar0_present_hwtcl 0
set_instance_parameter_value hip pf5_bar0_size_hwtcl 12
set_instance_parameter_value hip pf5_bar0_type_hwtcl 1
set_instance_parameter_value hip pf5_bar1_prefetchable_hwtcl 1
set_instance_parameter_value hip pf5_bar1_present_hwtcl 0
set_instance_parameter_value hip pf5_bar1_size_hwtcl 12
set_instance_parameter_value hip pf5_bar2_prefetchable_hwtcl 1
set_instance_parameter_value hip pf5_bar2_present_hwtcl 0
set_instance_parameter_value hip pf5_bar2_size_hwtcl 12
set_instance_parameter_value hip pf5_bar2_type_hwtcl 1
set_instance_parameter_value hip pf5_bar3_prefetchable_hwtcl 1
set_instance_parameter_value hip pf5_bar3_present_hwtcl 0
set_instance_parameter_value hip pf5_bar3_size_hwtcl 12
set_instance_parameter_value hip pf5_bar4_prefetchable_hwtcl 1
set_instance_parameter_value hip pf5_bar4_present_hwtcl 0
set_instance_parameter_value hip pf5_bar4_size_hwtcl 12
set_instance_parameter_value hip pf5_bar4_type_hwtcl 1
set_instance_parameter_value hip pf5_bar5_prefetchable_hwtcl 1
set_instance_parameter_value hip pf5_bar5_present_hwtcl 0
set_instance_parameter_value hip pf5_bar5_size_hwtcl 12
set_instance_parameter_value hip pf5_class_code_hwtcl 0
set_instance_parameter_value hip pf5_device_id_hwtcl 0
set_instance_parameter_value hip pf5_exprom_bar_present_hwtcl 0
set_instance_parameter_value hip pf5_exprom_bar_size_hwtcl 12
set_instance_parameter_value hip pf5_interrupt_pin_hwtcl inta
set_instance_parameter_value hip pf5_intr_line_hwtcl 0
set_instance_parameter_value hip pf5_msi_multi_message_capable_hwtcl 4
set_instance_parameter_value hip pf5_msix_pba_bir_hwtcl 0
set_instance_parameter_value hip pf5_msix_pba_offset_hwtcl 0
set_instance_parameter_value hip pf5_msix_table_bir_hwtcl 0
set_instance_parameter_value hip pf5_msix_table_offset_hwtcl 0
set_instance_parameter_value hip pf5_msix_table_size_hwtcl 0
set_instance_parameter_value hip pf5_pci_prog_intfc_byte_hwtcl 0
set_instance_parameter_value hip pf5_revision_id_hwtcl 0
set_instance_parameter_value hip pf5_subclass_code_hwtcl 0
set_instance_parameter_value hip pf5_subsystem_device_id_hwtcl 0
set_instance_parameter_value hip pf5_subsystem_vendor_id_hwtcl 0
set_instance_parameter_value hip pf5_vendor_id_hwtcl 0
set_instance_parameter_value hip pf5_vf_device_id_hwtcl 0
set_instance_parameter_value hip pf5_vf_subsystem_device_id_hwtcl 0
set_instance_parameter_value hip pf5_virtio_capability_present_hwtcl 0
set_instance_parameter_value hip pf5_virtio_cmn_config_bar_indicator_hwtcl 0
set_instance_parameter_value hip pf5_virtio_cmn_config_bar_offset_hwtcl 0
set_instance_parameter_value hip pf5_virtio_cmn_config_structure_length_hwtcl 0
set_instance_parameter_value hip pf5_virtio_device_specific_cap_present_hwtcl 0
set_instance_parameter_value hip pf5_virtio_devspecific_bar_indicator_hwtcl 0
set_instance_parameter_value hip pf5_virtio_devspecific_bar_offset_hwtcl 0
set_instance_parameter_value hip pf5_virtio_devspecific_structure_length_hwtcl 0
set_instance_parameter_value hip pf5_virtio_isrstatus_bar_indicator_hwtcl 0
set_instance_parameter_value hip pf5_virtio_isrstatus_bar_offset_hwtcl 0
set_instance_parameter_value hip pf5_virtio_isrstatus_structure_length_hwtcl 0
set_instance_parameter_value hip pf5_virtio_notification_bar_indicator_hwtcl 0
set_instance_parameter_value hip pf5_virtio_notification_bar_offset_hwtcl 0
set_instance_parameter_value hip pf5_virtio_notification_structure_length_hwtcl 0
set_instance_parameter_value hip pf5_virtio_notify_off_multiplier_hwtcl 0
set_instance_parameter_value hip pf5_virtio_pciconfig_access_bar_indicator_hwtcl 0
set_instance_parameter_value hip pf5_virtio_pciconfig_access_bar_offset_hwtcl 0
set_instance_parameter_value hip pf5_virtio_pciconfig_access_structure_length_hwtcl 0
set_instance_parameter_value hip pf6_bar0_prefetchable_hwtcl 1
set_instance_parameter_value hip pf6_bar0_present_hwtcl 0
set_instance_parameter_value hip pf6_bar0_size_hwtcl 12
set_instance_parameter_value hip pf6_bar0_type_hwtcl 1
set_instance_parameter_value hip pf6_bar1_prefetchable_hwtcl 1
set_instance_parameter_value hip pf6_bar1_present_hwtcl 0
set_instance_parameter_value hip pf6_bar1_size_hwtcl 12
set_instance_parameter_value hip pf6_bar2_prefetchable_hwtcl 1
set_instance_parameter_value hip pf6_bar2_present_hwtcl 0
set_instance_parameter_value hip pf6_bar2_size_hwtcl 12
set_instance_parameter_value hip pf6_bar2_type_hwtcl 1
set_instance_parameter_value hip pf6_bar3_prefetchable_hwtcl 1
set_instance_parameter_value hip pf6_bar3_present_hwtcl 0
set_instance_parameter_value hip pf6_bar3_size_hwtcl 12
set_instance_parameter_value hip pf6_bar4_prefetchable_hwtcl 1
set_instance_parameter_value hip pf6_bar4_present_hwtcl 0
set_instance_parameter_value hip pf6_bar4_size_hwtcl 12
set_instance_parameter_value hip pf6_bar4_type_hwtcl 1
set_instance_parameter_value hip pf6_bar5_prefetchable_hwtcl 1
set_instance_parameter_value hip pf6_bar5_present_hwtcl 0
set_instance_parameter_value hip pf6_bar5_size_hwtcl 12
set_instance_parameter_value hip pf6_class_code_hwtcl 0
set_instance_parameter_value hip pf6_device_id_hwtcl 0
set_instance_parameter_value hip pf6_exprom_bar_present_hwtcl 0
set_instance_parameter_value hip pf6_exprom_bar_size_hwtcl 12
set_instance_parameter_value hip pf6_interrupt_pin_hwtcl inta
set_instance_parameter_value hip pf6_intr_line_hwtcl 0
set_instance_parameter_value hip pf6_msi_multi_message_capable_hwtcl 4
set_instance_parameter_value hip pf6_msix_pba_bir_hwtcl 0
set_instance_parameter_value hip pf6_msix_pba_offset_hwtcl 0
set_instance_parameter_value hip pf6_msix_table_bir_hwtcl 0
set_instance_parameter_value hip pf6_msix_table_offset_hwtcl 0
set_instance_parameter_value hip pf6_msix_table_size_hwtcl 0
set_instance_parameter_value hip pf6_pci_prog_intfc_byte_hwtcl 0
set_instance_parameter_value hip pf6_revision_id_hwtcl 0
set_instance_parameter_value hip pf6_subclass_code_hwtcl 0
set_instance_parameter_value hip pf6_subsystem_device_id_hwtcl 0
set_instance_parameter_value hip pf6_subsystem_vendor_id_hwtcl 0
set_instance_parameter_value hip pf6_vendor_id_hwtcl 0
set_instance_parameter_value hip pf6_vf_device_id_hwtcl 0
set_instance_parameter_value hip pf6_vf_subsystem_device_id_hwtcl 0
set_instance_parameter_value hip pf6_virtio_capability_present_hwtcl 0
set_instance_parameter_value hip pf6_virtio_cmn_config_bar_indicator_hwtcl 0
set_instance_parameter_value hip pf6_virtio_cmn_config_bar_offset_hwtcl 0
set_instance_parameter_value hip pf6_virtio_cmn_config_structure_length_hwtcl 0
set_instance_parameter_value hip pf6_virtio_device_specific_cap_present_hwtcl 0
set_instance_parameter_value hip pf6_virtio_devspecific_bar_indicator_hwtcl 0
set_instance_parameter_value hip pf6_virtio_devspecific_bar_offset_hwtcl 0
set_instance_parameter_value hip pf6_virtio_devspecific_structure_length_hwtcl 0
set_instance_parameter_value hip pf6_virtio_isrstatus_bar_indicator_hwtcl 0
set_instance_parameter_value hip pf6_virtio_isrstatus_bar_offset_hwtcl 0
set_instance_parameter_value hip pf6_virtio_isrstatus_structure_length_hwtcl 0
set_instance_parameter_value hip pf6_virtio_notification_bar_indicator_hwtcl 0
set_instance_parameter_value hip pf6_virtio_notification_bar_offset_hwtcl 0
set_instance_parameter_value hip pf6_virtio_notification_structure_length_hwtcl 0
set_instance_parameter_value hip pf6_virtio_notify_off_multiplier_hwtcl 0
set_instance_parameter_value hip pf6_virtio_pciconfig_access_bar_indicator_hwtcl 0
set_instance_parameter_value hip pf6_virtio_pciconfig_access_bar_offset_hwtcl 0
set_instance_parameter_value hip pf6_virtio_pciconfig_access_structure_length_hwtcl 0
set_instance_parameter_value hip pf7_bar0_prefetchable_hwtcl 1
set_instance_parameter_value hip pf7_bar0_present_hwtcl 0
set_instance_parameter_value hip pf7_bar0_size_hwtcl 12
set_instance_parameter_value hip pf7_bar0_type_hwtcl 1
set_instance_parameter_value hip pf7_bar1_prefetchable_hwtcl 1
set_instance_parameter_value hip pf7_bar1_present_hwtcl 0
set_instance_parameter_value hip pf7_bar1_size_hwtcl 12
set_instance_parameter_value hip pf7_bar2_prefetchable_hwtcl 1
set_instance_parameter_value hip pf7_bar2_present_hwtcl 0
set_instance_parameter_value hip pf7_bar2_size_hwtcl 12
set_instance_parameter_value hip pf7_bar2_type_hwtcl 1
set_instance_parameter_value hip pf7_bar3_prefetchable_hwtcl 1
set_instance_parameter_value hip pf7_bar3_present_hwtcl 0
set_instance_parameter_value hip pf7_bar3_size_hwtcl 12
set_instance_parameter_value hip pf7_bar4_prefetchable_hwtcl 1
set_instance_parameter_value hip pf7_bar4_present_hwtcl 0
set_instance_parameter_value hip pf7_bar4_size_hwtcl 12
set_instance_parameter_value hip pf7_bar4_type_hwtcl 1
set_instance_parameter_value hip pf7_bar5_prefetchable_hwtcl 1
set_instance_parameter_value hip pf7_bar5_present_hwtcl 0
set_instance_parameter_value hip pf7_bar5_size_hwtcl 12
set_instance_parameter_value hip pf7_class_code_hwtcl 0
set_instance_parameter_value hip pf7_device_id_hwtcl 0
set_instance_parameter_value hip pf7_exprom_bar_present_hwtcl 0
set_instance_parameter_value hip pf7_exprom_bar_size_hwtcl 12
set_instance_parameter_value hip pf7_interrupt_pin_hwtcl inta
set_instance_parameter_value hip pf7_intr_line_hwtcl 0
set_instance_parameter_value hip pf7_msi_multi_message_capable_hwtcl 4
set_instance_parameter_value hip pf7_msix_pba_bir_hwtcl 0
set_instance_parameter_value hip pf7_msix_pba_offset_hwtcl 0
set_instance_parameter_value hip pf7_msix_table_bir_hwtcl 0
set_instance_parameter_value hip pf7_msix_table_offset_hwtcl 0
set_instance_parameter_value hip pf7_msix_table_size_hwtcl 0
set_instance_parameter_value hip pf7_pci_prog_intfc_byte_hwtcl 0
set_instance_parameter_value hip pf7_revision_id_hwtcl 0
set_instance_parameter_value hip pf7_subclass_code_hwtcl 0
set_instance_parameter_value hip pf7_subsystem_device_id_hwtcl 0
set_instance_parameter_value hip pf7_subsystem_vendor_id_hwtcl 0
set_instance_parameter_value hip pf7_vendor_id_hwtcl 0
set_instance_parameter_value hip pf7_vf_device_id_hwtcl 0
set_instance_parameter_value hip pf7_vf_subsystem_device_id_hwtcl 0
set_instance_parameter_value hip pf7_virtio_capability_present_hwtcl 0
set_instance_parameter_value hip pf7_virtio_cmn_config_bar_indicator_hwtcl 0
set_instance_parameter_value hip pf7_virtio_cmn_config_bar_offset_hwtcl 0
set_instance_parameter_value hip pf7_virtio_cmn_config_structure_length_hwtcl 0
set_instance_parameter_value hip pf7_virtio_device_specific_cap_present_hwtcl 0
set_instance_parameter_value hip pf7_virtio_devspecific_bar_indicator_hwtcl 0
set_instance_parameter_value hip pf7_virtio_devspecific_bar_offset_hwtcl 0
